# Altium schematic sheet UAVCAN_rooms-SchDoc.SchDoc
size 431 x 279 mm; SheetNumber: 1; SheetTotal: 2
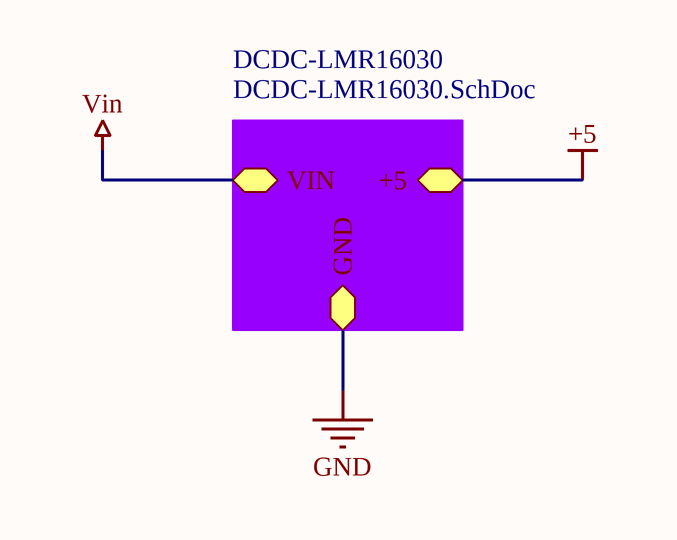
[diagram p0: UAVCAN_rooms-SchDoc.SchDoc]

## Sub-sheets
DCDC-LMR16030 = DCDC-LMR16030.SchDoc: GND (bidir), VIN (bidir), +5 (bidir)

## Nets
+5: sheet DCDC-LMR16030/+5
GND: sheet DCDC-LMR16030/GND
Vin: sheet DCDC-LMR16030/VIN

## Notes on the sheet
- DWG. NO.
- REV.
- SHT.
- THIS DOCUMENT AND THE DATA DISCLOSED HEREIN OR HEREWITH IS THE PROPERTY OF ALTIUM LIMITED AND MAY BE FREELY DISTRIBUTED IN WHOLE. NO RIGHTS ARE RESERVED OR EXPRESS OR IMPLIED WARANTEE GIVEN.
- REVISION
- DESCRIPTION
- DATE
- APPROVED
- ENG:
- APPROVALS
- PROJECT
- DSN:
- CHK:
- REFERENCE DOCUMENTS
- PROJECT REVISION:
- TITLE
- DOCUMENT REVISION:
- DESIGN ITEM:
- BOM:
- FAB DWG:
- PCB DWG:
- ASSY DWG:
- SCALE:
- SIZE
- B
- CAGE CODE
- FILE NAME
- DWG NO.
- SHEET
- OF
- REV